# EAGLE schematic RFCS-RJ45 Foot Pedal (EAGLE 9.0.1)
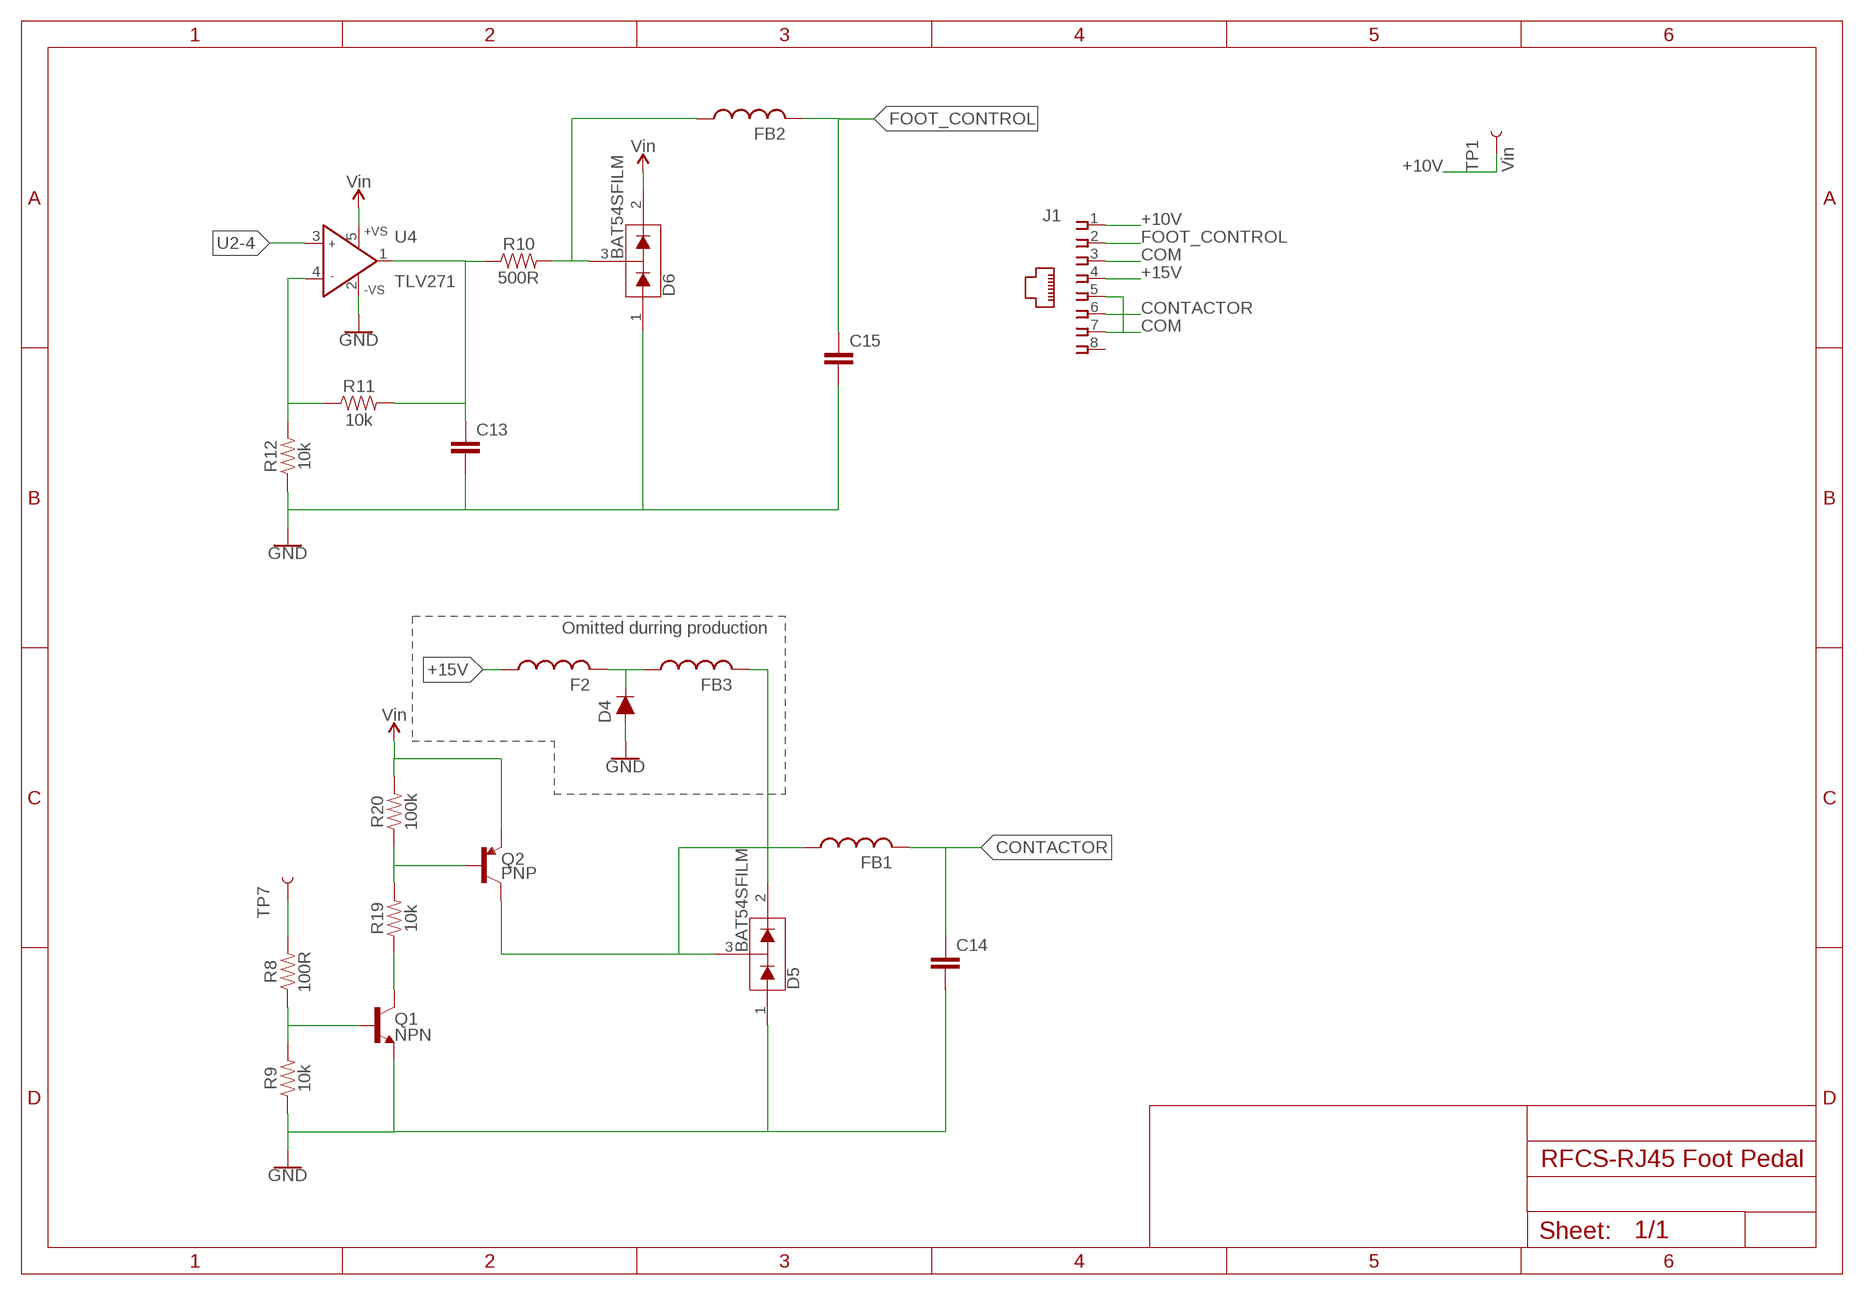
[diagram p0: schematic, sheet 1]

## Parts
C13  C-EUC0402K  [C0402K]
C14  C-EUC0402K  [C0402K]
C15  C-EUC0402K  [C0402K]
D4  DIODE-BAS16J  [SOD-323]
D5  BAT54SFILM  BAV99  [SOT23-3]
D6  BAT54SFILM  BAV99  [SOT23-3]
F2  L-USL1812  [L1812]
FB1  L-USL1812  [L1812]
FB2  L-USL1812  [L1812]
FB3  L-USL1812  [L1812]
J1  0446200001  [0446200001]
Q1  NPN  TRANS_NPN-MMBT2222AL  [SOT23-3]
Q2  PNP  TRANS_PNP-MMBT4403  [SOT23-3]
R8  100R  RESISTOR0603  [0603]
R9  10k  RESISTOR0603  [0603]
R10  500R  RESISTOR0603  [0603]
R11  10k  RESISTOR0603  [0603]
R12  10k  RESISTOR0603  [0603]
R19  10k  RESISTOR0603  [0603]
R20  100k  RESISTOR0603  [0603]
TP1  Vin  TEST-POINT2  [PAD.02X.02]
TP7  TEST-POINT2  [PAD.02X.02]
U4  TLV271  AD8541KS  [SC70-5]

## Nets
+10V: J1.1 TP1.P$1
+15V: F2.1 J1.4
COM: J1.3 J1.5 J1.7
CONTACTOR: C14.1 FB1.2 J1.6
FOOT_CONTROL: C15.1 FB2.2 J1.2
GND: C13.2 C14.2 C15.2 D4.A D5.1(A1) D6.1(A1) Q1.2(E) R9.1 R12.1 U4.2(-VS)
N$1: R8.2 TP7.P$1
N$2: Q1.1(B) R8.1 R9.2
N$3: D5.3(COM) FB1.1 Q2.3(C)
N$4: Q1.3(C) R19.1
N$5: Q2.1(B) R19.2 R20.1
N$7: D4.C F2.2 FB3.1
N$8: R11.1 R12.2 U4.4(IN-)
N$9: D5.2(C2) FB3.2
N$10: C13.1 R10.1 R11.2 U4.1(OUT)
N$12: D6.3(COM) FB2.1 R10.2
U2-4: U4.3(IN+)
VCC_1: D6.2(C2) Q2.2(E) R20.2 U4.5(+VS) ; supply symbol labelled Vin
Unconnected: J1.8

## Notes on the sheet
- Omitted durring production

## Library data of the parts
C13-C15 = rcl:C-EU: CAPACITOR, European symbol; SPICEPREFIX: C
D4 = SparkFun-DiscreteSemi:DIODE: Diode These are standard reverse protection diodes and small signal diodes. SparkFun Products: SparkFun SparkPunk Sound Kit <https://www.sparkfun.com/products/11177> SparkFun ESP8266 Thing <https://www.sparkfun.com/products/13231>; PROD_ID: DIO-09646; VALUE: 250mA/100V
D5 D6 = SparkFun-DiscreteSemi:BAV99: Series-pair diode array Two small signal silicon diodes connected anode to cathode. Connections to all three nodes available. Link to datasheet <https://www.fairchildsemi.com/datasheets/BA/BAV99.pdf> SparkFun Products: SparkFun AutoDriver <https://www.sparkfun.com/products/13752>; PROD_ID: DIO-10647; VALUE: 200mA/70V
F2 FB1-FB3 = resistor:L-US: INDUCTOR, American symbol
J1 = con-molex:0446200001: RJ-45 INVERTED MODULAR JACK ASSEMBLY WITH RJ-11 KEEPOUT FEATURE Source: Data sheet <http://www.farnell.com/datasheets/73207.pdf>; MF: MOLEX; OC_FARNELL: unknown
Q1 = SparkFun-DiscreteSemi:TRANS_NPN: NPN transistor Current controlled devices typically used to amplify current or used as a switch. BC547 - COM-08928 <http://www.sparkfun.com/products/8928> (TO-92 45V 100mA) (1.Collector 2.Base 3.Emitter) 2N3904 - COM-00521 <http://www.sparkfun.com/products/521> (TO-92 40V 200mA) (1.Emitter 2.Base 3.Collector) P2N2222A - COM-12852 <http://www.sparkfun.com/products/12852> (TO-92 40V 600mA) (1.Collector 2.Base 3.Emitter); PROD_ID: TRANS-08049; VALUE: 600mA/40V
Q2 = SparkFun-DiscreteSemi:TRANS_PNP: PNP transistor Current controlled devices typically used to amplify current or used as a switch. SparkFun Products: SparkFun Serial Enabled 16x2 LCD - Red on Black <https://www.sparkfun.com/products/9068> SparkFun Logomatic <https://www.sparkfun.com/products/12772>; PROD_ID: TRANS-09245; VALUE: 600mA/40V
R8-R12 R19 R20 = SparkFun-Resistors:RESISTOR: Generic Resistor Package
TP1 TP7 = SparkFun-Connectors:TEST-POINT: SparkFun Test Points Bare copper test points for troubleshooting or In-Circuit-Testing. These are used by our Production team for verifying production board runs using pogo-pins on test beds. SparkFun Products: SparkFun LSM9DS1 Breakout <https://www.sparkfun.com/products/13284> SparkFun PSOC <https://www.sparkfun.com/products/13714> SparkFun Load Cell Amplifier <https://www.sparkfun.com/products/13879>
U4 = analog-devices:AD8541: General-Purpose CMOS Rail-to-Rail Amplifiers Source: http://www.analog.com/static/imported-files/data_sheets/AD8541_8542_8544.pdf; MF: ALTERA CORPORATION; MPN: AD8541AKSZ-REEL7; OC_FARNELL: 1333253; OC_NEWARK: 59K6818